# Altium schematic sheet Module.SchDoc
size A4
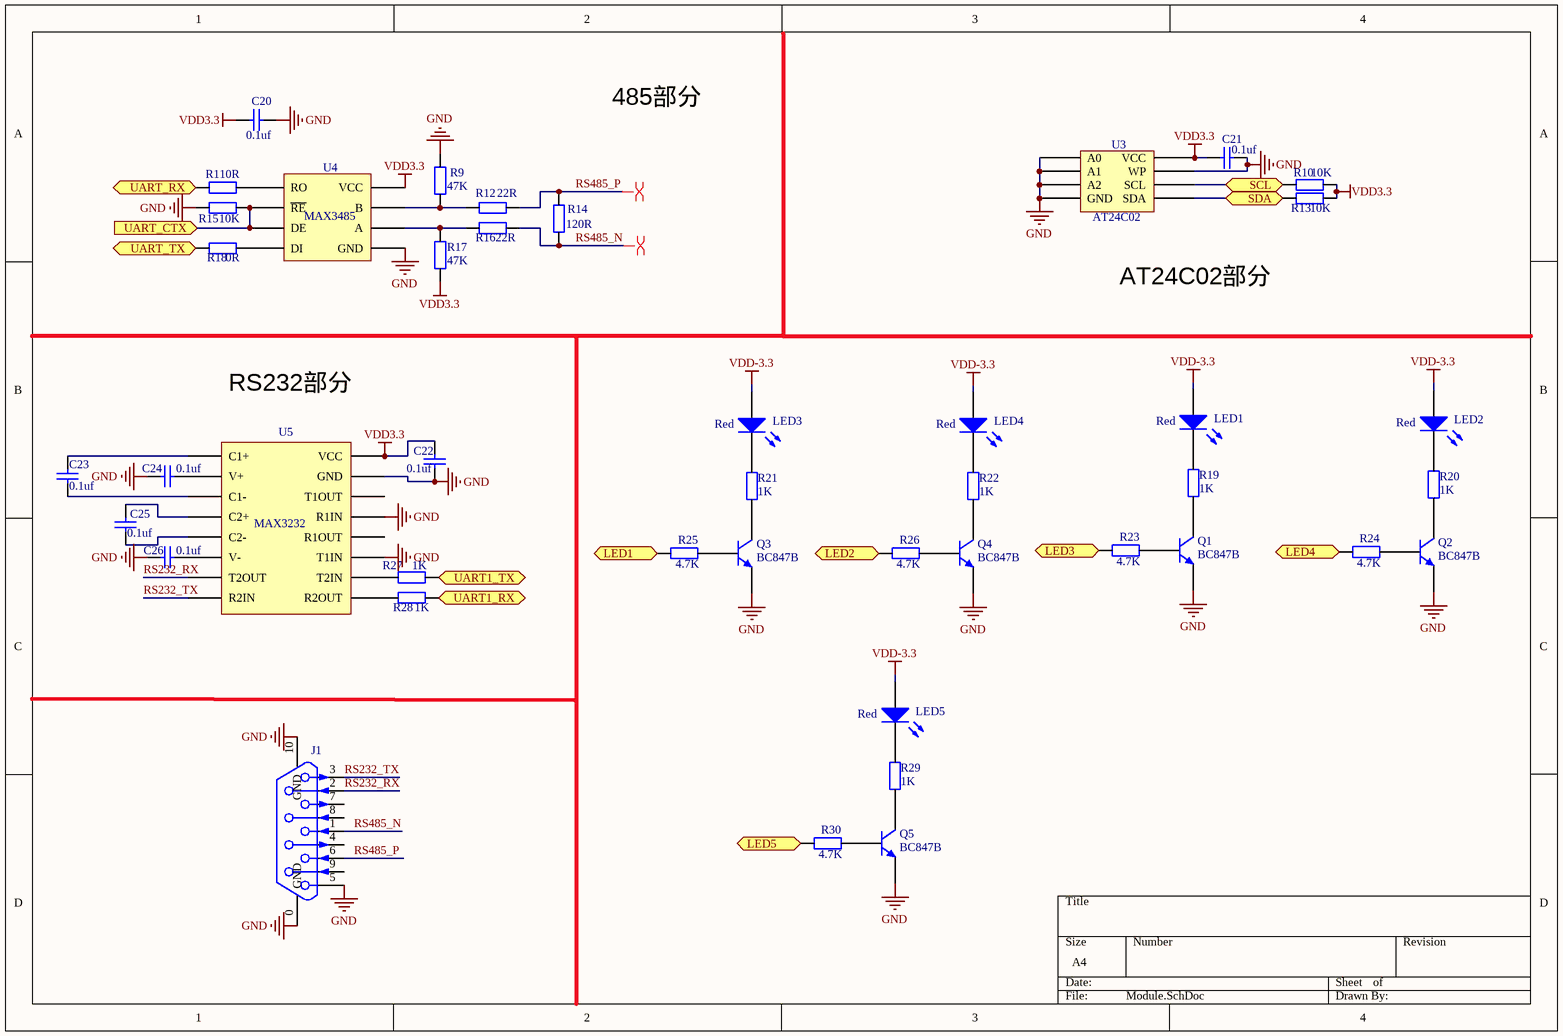
[diagram p0: Module.SchDoc]

## Parts
C20  value 0.1uf  [0603]  (hidden comment: Capacitor-0603)
C21  value 0.1uf  [0603]  (hidden comment: Capacitor-0603)
C22  value 0.1uf  [0603]  (hidden comment: Capacitor-0603)
C23  value 0.1uf  [0603]  (hidden comment: Capacitor-0603)
C24  value 0.1uf  [0603]  (hidden comment: Capacitor-0603)
C25  value 0.1uf  [0603]  (hidden comment: Capacitor-0603)
C26  value 0.1uf  [0603]  (hidden comment: Capacitor-0603)
J1  DB9  [DB9]  (value not drawn)
LED1  Color: Red  [外插小灯]  (hidden comment: LED)
LED2  Color: Red  [外插小灯]  (hidden comment: LED)
LED3  Color: Red  [外插小灯]  (hidden comment: LED)
LED4  Color: Red  [外插小灯]  (hidden comment: LED)
LED5  Color: Red  [外插小灯]  (hidden comment: LED)
Q1  BC847  [BC847B]  (value not drawn)
Q2  BC847  [BC847B]  (value not drawn)
Q3  BC847  [BC847B]  (value not drawn)
Q4  BC847  [BC847B]  (value not drawn)
Q5  BC847  [BC847B]  (value not drawn)
R9  value 47K  [0603]  (hidden comment: Resistor-0603)
R10  value 10K  [0603]  (hidden comment: Resistor-0603)
R11  value 0R  [0603]  (hidden comment: Resistor-0603)
R12  value 22R  [0603]  (hidden comment: Resistor-0603)
R13  value 10K  [0603]  (hidden comment: Resistor-0603)
R14  value 120R  [0603]  (hidden comment: Resistor-0603)
R15  value 10K  [0603]  (hidden comment: Resistor-0603)
R16  value 22R  [0603]  (hidden comment: Resistor-0603)
R17  value 47K  [0603]  (hidden comment: Resistor-0603)
R18  value 0R  [0603]  (hidden comment: Resistor-0603)
R19  value 1K  [0603]  (hidden comment: Resistor-0603)
R20  value 1K  [0603]  (hidden comment: Resistor-0603)
R21  value 1K  [0603]  (hidden comment: Resistor-0603)
R22  value 1K  [0603]  (hidden comment: Resistor-0603)
R23  value 4.7K  [0603]  (hidden comment: Resistor-0603)
R24  value 4.7K  [0603]  (hidden comment: Resistor-0603)
R25  value 4.7K  [0603]  (hidden comment: Resistor-0603)
R26  value 4.7K  [0603]  (hidden comment: Resistor-0603)
R27  value 1K  [0603]  (hidden comment: Resistor-0603)
R28  value 1K  [0603]  (hidden comment: Resistor-0603)
R29  value 1K  [0603]  (hidden comment: Resistor-0603)
R30  value 4.7K  [0603]  (hidden comment: Resistor-0603)
U3  AT24C02  [AT24C02]
U4  MAX3485  [MAX3485]
U5  MAX3232  [MAX3232]

## Ports
LED1 (in), LED2 (in), LED3 (in), LED4 (in), LED5 (in), SCL, SDA, UART1_RX (out), UART1_TX (in), UART_CTX (in), UART_RX (out), UART_TX (in)

## Nets
GND: C20.2 C21.1 C22.1 C24.2 C26.2 J1.0(GND) J1.5 J1.10(GND) Q1.1(E) Q2.1(E) Q3.1(E) Q4.1(E) Q5.1(E) R9.2 R15.1 U3.1(A0) U3.2(A1) U3.3(A2) U3.4(GND) U3.7(WP) U4.5(GND) U5.11(T1IN) U5.13(R1IN) U5.15(GND)
VDD3.3: C20.1 C21.2 C22.2 R10.1 R13.1 R17.1 U3.8(VCC) U4.8(VCC) U5.16(VCC)
VDD-3.3: LED1.1(A) LED2.1(A) LED3.1(A) LED4.1(A) LED5.1(A)
LED1: R25.2 ; port LED1
LED2: R26.2 ; port LED2
LED3: R23.2 ; port LED3
LED4: R24.2 ; port LED4
LED5: R30.2 ; port LED5
RS232_RX: J1.2 U5.7(T2OUT)
RS232_TX: J1.3 U5.8(R2IN)
RS485_N: J1.1 R14.2 R16.1
RS485_P: J1.6 R12.1 R14.1
SCL: R10.2 U3.6(SCL) ; port SCL
SDA: R13.2 U3.5(SDA) ; port SDA
UART1_RX: R28.1 ; port UART1_RX
UART1_TX: R27.1 ; port UART1_TX
UART_CTX: R15.2 U4.2(~{RE}) U4.3(DE) ; port UART_CTX
UART_RX: R11.1 ; port UART_RX
UART_TX: R18.1 ; port UART_TX
NetC23_1: C23.1 U5.3(C1-)
NetC23_2: C23.2 U5.1(C1+)
NetC24_1: C24.1 U5.2(V+)
NetC25_1: C25.1 U5.5(C2-)
NetC25_2: C25.2 U5.4(C2+)
NetC26_1: C26.1 U5.6(V-)
NetLED1_2: LED1.2 R19.2
NetLED2_2: LED2.2 R20.2
NetLED3_2: LED3.2 R21.2
NetLED4_2: LED4.2 R22.2
NetLED5_2: LED5.2 R29.2
NetQ1_2: Q1.2(B) R23.1
NetQ1_3: Q1.3(C) R19.1
NetQ2_2: Q2.2(B) R24.1
NetQ2_3: Q2.3(C) R20.1
NetQ3_2: Q3.2(B) R25.1
NetQ3_3: Q3.3(C) R21.1
NetQ4_2: Q4.2(B) R26.1
NetQ4_3: Q4.3(C) R22.1
NetQ5_2: Q5.2(B) R30.1
NetQ5_3: Q5.3(C) R29.1
NetR9_1: R9.1 R12.2 U4.7(B)
NetR11_2: R11.2 U4.1(RO)
NetR16_2: R16.2 R17.2 U4.6(A)
NetR18_2: R18.2 U4.4(DI)
NetR27_2: R27.2 U5.10(T2IN)
NetR28_2: R28.2 U5.9(R2OUT)

Not connected (* = marked no-connect by the designer): J1 4 7 8 9; U5 12(R1OUT) 14(T1OUT)

## Layout directives
differential pair: RS485_N, RS485_P

## Notes on the sheet
- 485部分
- AT24C02部分
- RS232部分

## Library data of the parts
LED1-LED5 = LED: Value: LED
Q1-Q5 = BC847: Name: BC847B
U3 = AT24C02: Name: AT24C02
U4 = MAX3485: Name: MAX3485
U5 = MAX3232: Name: MAX3232